# Altium schematic sheet 24V_Power.SchDoc: Багатоканальний пристрій регулювання потужності
size 420 x 297 mm; CheckedBy: Хоменко М.А.; Author: Шокодько Д.А.; CompanyName: НУЧП; DocumentNumber: МРА.ЕН 14194617; Revision: Хоменко М.А.; SheetNumber: 3; SheetTotal: 4; Scale: 1:1; Title2str: електричних нагрівальних елементів; DocumentType: Схема електрична принципова; FirstReferrence: АБВГ.123456.001; T_Contr: Хоменко М.А.; N_Contr: Хоменко М.А.
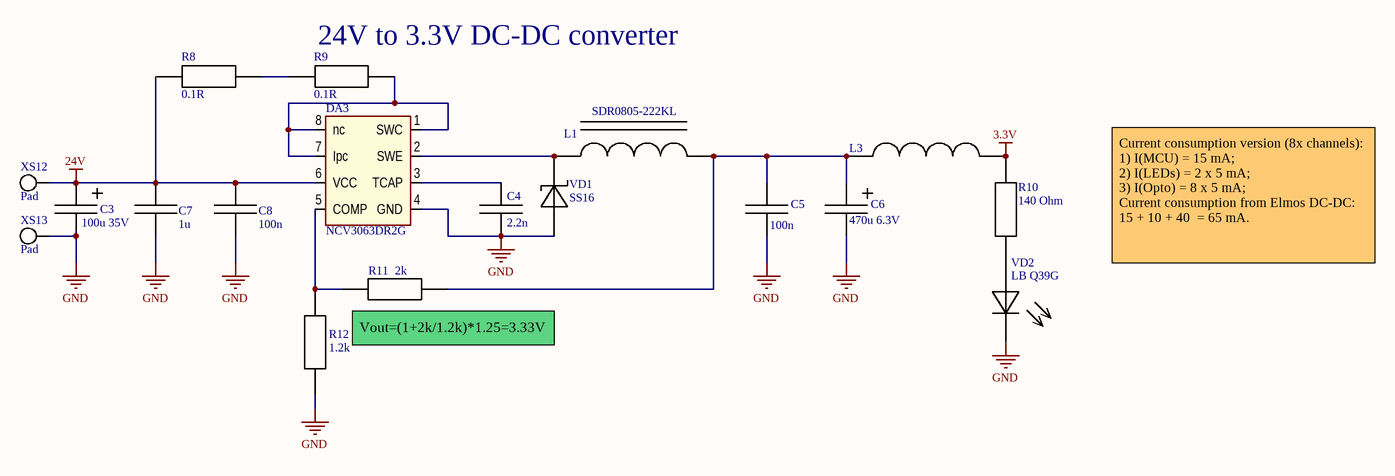
[diagram p0: 24V_Power.SchDoc]

## Parts
C3  100u 35V  [C8*12-3.5]
C4  2.2n  [C0603]
C5  100n  [C0603]
C6  470u 6.3V  [C6.3*11-2.5]
C7  1u  [C1206]
C8  100n  [C0603]
DA3  NCV3063DR2G  [SOIC-8 NB]
L1  SDR0805-222KL  [SDR0805]
L3  BLM21PG331SN1D  [INDC2012X08N]  (value not drawn)
R8  0.1R  [R1206]
R9  0.1R  [R1206]
R10  140 Ohm  [R0603]
R11  2k  [R0603]
R12  1.2k  [R0603]
VD1  SS16  [shotci]
VD2  LB Q39G  [0603D_R]
XS12  Pad  [LOTPAD]
XS13  Pad  [LOTPAD]

## Nets
3.3V: L3.2 R10.2
24V: C3.1 C7.2 C8.2 DA3.6(VCC) R8.1 XS12.1
GND: C3.2 C4.1 C5.1 C6.2 C7.1 C8.1 DA3.4(GND) R12.1 VD1.1(А) VD2.2(К) XS13.1
NetC4_2: C4.2 DA3.3(TCAP)
NetC5_2: C5.2 C6.1 L1.2 L3.1 R11.2
NetDA3_1: DA3.1(SWC) DA3.7(Ipc) DA3.8(nc) R9.2
NetDA3_2: DA3.2(SWE) L1.1 VD1.2(К)
NetDA3_5: DA3.5(COMP) R11.1 R12.2
NetR8_2: R8.2 R9.1
NetR10_1: R10.1 VD2.1(А)

## Notes on the sheet
- (near R9) 24V to 3.3V DC-DC converter
- Current consumption version (8x channels):
  1) I(MCU) = 15 mA;
  2) I(LEDs) = 2 x 5 mA;
  3) I(Opto) = 8 x 5 mA;
  Current consumption from Elmos DC-DC:
  15 + 10 + 40  = 65 mA.
- (near R11) Vout=(1+2k/1.2k)*1.25=3.33V
- Перше використання
- Довідн. №
- Підп. і дата
- Інв. № дубл.
- Взамін інв. №
- Розроб.
- Зм.
- Лист
- № докум.
- Підп.
- Дата
- Літ.
- Маса
- Масштаб
- Перевір.
- Т.контр.
- Листів
- Інв. № оригін.
- Затв.
- Н.контр.
- 2.106-A3
- Формат А3

## Library data of the parts
C3 = 100u 35V: Capasitor
C4 = 2.2n: Capasitor 0603
C5 C8 = 100n: Capasitor 0603
C6 = 470u 6.3V: Capasitor
C7 = 1u: Capasitor 1206
DA3 = NCV3063DR2G: 1.5 A, ADJ, Step-Up/Down/ / Inverting Switching / Regulators, SOIC-8
L1 = 2200uH: SMD Power Inductor
L3 = BLM21PG331SN1D: Ferrite bead smd
R8 R9 = 0.1R: Reisitor 1206
R10 = 140 Ohm: Resistor 0603
R11 = 2k: Resistor 0603
R12 = 1.2k: Resistor 0603
VD1 = SS16: Surface Mount Schottky Barrier Rectifier
VD2 = RED_LED: Power Led
XS12 XS13 = Pad: PCB TH Pad